# EAGLE schematic ArduboyBoard (EAGLE 7.7.0)
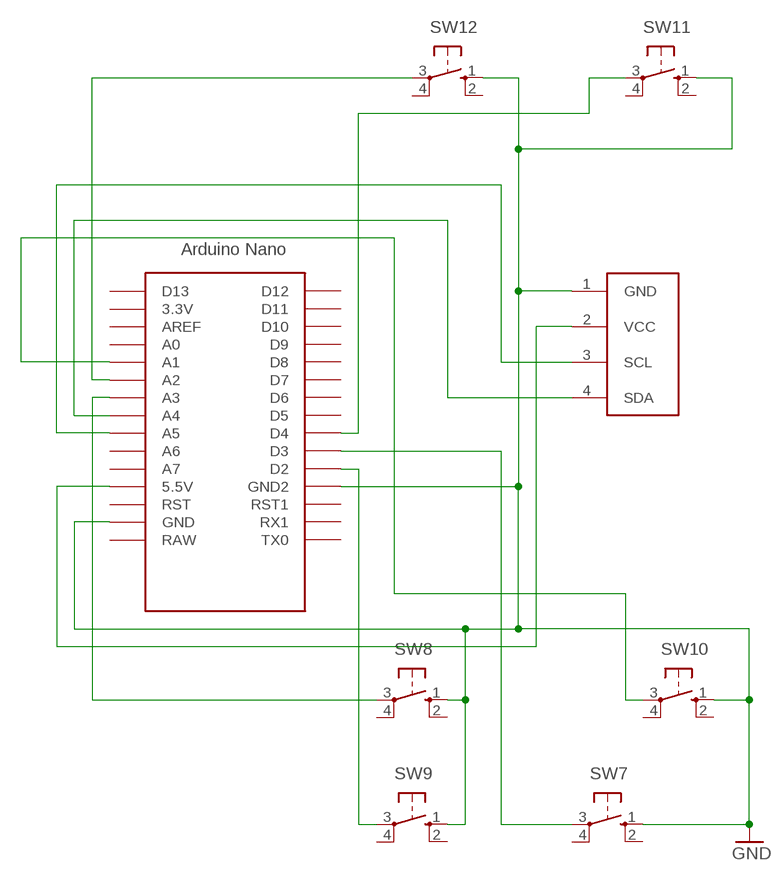
[diagram p0: schematic, sheet 1]

## Parts
SW7  10-XX  [B3F-10XX]
SW8  10-XX  [B3F-10XX]
SW9  10-XX  [B3F-10XX]
SW10  10-XX  [B3F-10XX]
SW11  10-XX  [B3F-10XX]
SW12  10-XX  [B3F-10XX]
U$1  NANO  [NANO]
U$2  I2C_OLED  [I2C_OLED_PACKAGE]

## Nets
GND: SW7.1(S) SW8.1(S) SW9.1(S) SW10.1(S) SW11.1(S) SW12.1(S) U$1.GND U$1.GND1(GND2) U$2.1(GND)
N$1: U$1.A5 U$2.3(SCL)
N$2: U$1.A4 U$2.4(SDA)
N$3: U$1.5V(5.5V) U$2.2(VCC)
N$5: SW8.3(P) U$1.A3
N$7: SW12.3(P) U$1.A2
N$9: SW10.3(P) U$1.A1
N$10: SW9.3(P) U$1.D2
N$11: SW7.3(P) U$1.D3
N$12: SW11.3(P) U$1.D4
Unconnected: SW7.2(S1) SW7.4(P1) SW8.2(S1) SW8.4(P1) SW9.2(S1) SW9.4(P1) SW10.2(S1) SW10.4(P1) SW11.2(S1) SW11.4(P1) SW12.2(S1) SW12.4(P1) U$1.3.3V U$1.A0 U$1.A6 U$1.A7 U$1.AREF U$1.D5 U$1.D6 U$1.D7 U$1.D8 U$1.D9 U$1.D10 U$1.D11 U$1.D12 U$1.D13 U$1.ICSP1 U$1.ICSP2 U$1.ICSP3 U$1.ICSP4 U$1.ICSP5 U$1.ICSP6 U$1.RAW U$1.RST U$1.RST1 U$1.RX1 U$1.TX0

## Library data of the parts
SW7-SW12 = buttons:10-XX: OMRON SWITCH
U$1 = Arduino-clone:NANO: Arduino Nano
U$2 = DIYMall_OLED:I2C_OLED